# Altium schematic sheet OtherSensors.SchDoc
size A3; SheetNumber: 3; SheetTotal: 3
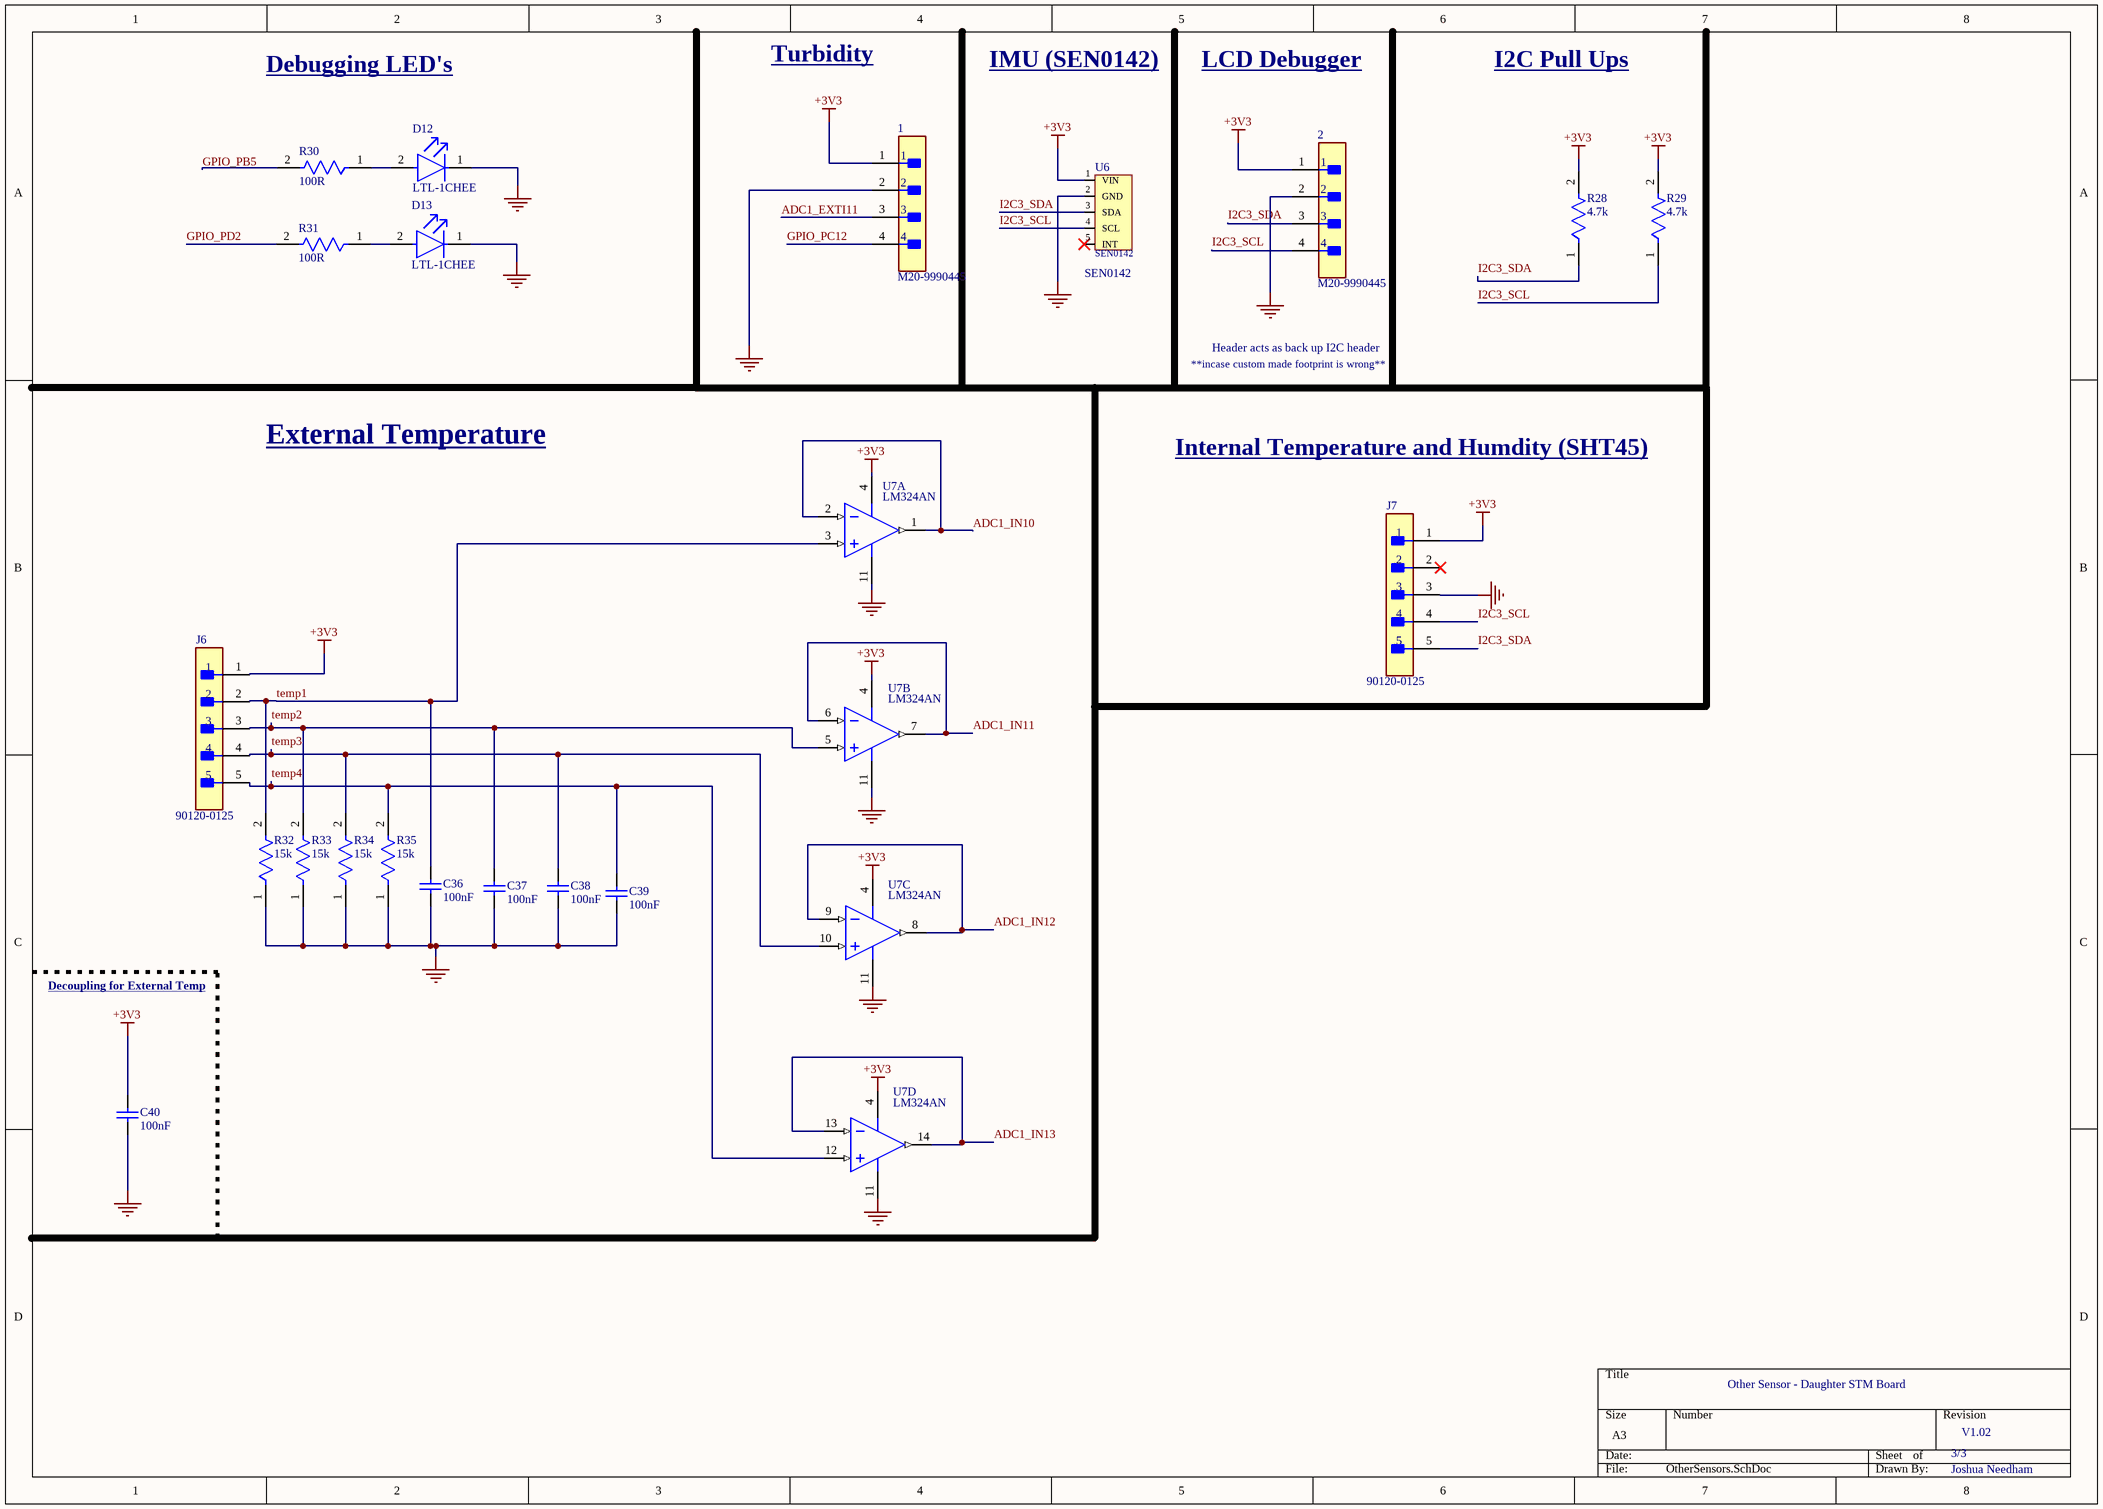
[diagram p0: OtherSensors.SchDoc]

## Parts
1  M20-9990445  [FP-M20-9990445-MFG]
2  M20-9990445  [FP-M20-9990445-MFG]
C36  100nF  [CAPC0805(2012)100_M]
C37  100nF  [CAPC0805(2012)100_M]
C38  100nF  [CAPC0805(2012)100_M]
C39  100nF  [CAPC0805(2012)100_M]
C40  100nF  [CAPC0805(2012)100_M]
D12  LTL-1CHEE  [FP-LTL-1CHEE-MFG]
D13  LTL-1CHEE  [FP-LTL-1CHEE-MFG]
J6  90120-0125  [FP-90120-0125-MFG]
J7  90120-0125  [FP-90120-0125-MFG]
R28  4.7k  [FP-CRCW0805-e3-IPC_A]
R29  4.7k  [FP-CRCW0805-e3-IPC_A]
R30  100R  [FP-CRCW0805-e3-IPC_A]
R31  100R  [FP-CRCW0805-e3-IPC_A]
R32  15k  [FP-CRCW0805-e3-IPC_A]
R33  15k  [FP-CRCW0805-e3-IPC_A]
R34  15k  [FP-CRCW0805-e3-IPC_A]
R35  15k  [FP-CRCW0805-e3-IPC_A]
U6  SEN0142  [PCBComponent_1]
U7  LM324AN  [N0014A]  (parts A,B,C,D of 4)

## Nets
+3V3: 1.1 2.1 C40.2 J6.1 J7.1 R28.2 R29.2 U6.1(VIN) U7.4(V+)
GND: 1.2 2.2 C36.1 C37.1 C38.1 C39.1 C40.1 D12.1(C) D13.1(C) J7.3 R32.1 R33.1 R34.1 R35.1 U6.2(GND) U7.11(GND)
ADC1_EXTI11: 1.3
ADC1_IN10: U7.1(OUT1) U7.2(IN1-)
ADC1_IN11: U7.6(IN2-) U7.7(OUT2)
ADC1_IN12: U7.8(OUT3) U7.9(IN3-)
ADC1_IN13: U7.13(IN4-) U7.14(OUT4)
GPIO_PB5: R30.2
GPIO_PC12: 1.4
GPIO_PD2: R31.2
I2C3_SCL: 2.4 J7.4 R29.1 U6.4(SCL)
I2C3_SDA: 2.3 J7.5 R28.1 U6.3(SDA)
temp1: C36.2 J6.2 R32.2 U7.3(IN1+)
temp2: C37.2 J6.3 R33.2 U7.5(IN2+)
temp3: C38.2 J6.4 R34.2 U7.10(IN3+)
temp4: C39.2 J6.5 R35.2 U7.12(IN4+)
NetD12_2: D12.2(A) R30.1
NetD13_2: D13.2(A) R31.1

Not connected (* = marked no-connect by the designer): J7 2*; U6 5(INT)*

## Notes on the sheet
- Debugging LED's
- Turbidity
- IMU (SEN0142)
- LCD Debugger
- I2C Pull Ups
- **incase custom made footprint is wrong**
- Header acts as back up I2C header
- External Temperature
- Internal Temperature and Humdity (SHT45)
- Decoupling for External Temp
- Other Sensor - Daughter STM Board
- 3/3
- V1.02
- Joshua Needham

## Library data of the parts
1 2 = CMP-00671-05399696-1: M20-9990445 Conn Unshrouded Header HDR 4 POS 2.54mm Solder ST Thru-Hole Bulk/Loose; Insulation Resistance: 10GΩ; Connector Type: Male Pin; Voltage Rating (DC): 750V; Max Current Rating: 3A; Contact Resistance: 25mΩ; Number of Contacts: 4; Gender: Male; Color: Black; Height: 2.54mm; Contact Material: Brass, Bronze, Gold, Nickel; Orientation: Straight; Width: 12.7mm; Mount: Through Hole; Pitch: 2.54mm; Lead Pitch: 2.54mm; RoHS: Compliant; Max Operating Temperature: 105°C; Case/Package: SIL; NexarPartId: 5399696; Depth: 2.54mm; Length: 10.16mm; Current Rating: 3A; Contact Plating: Gold; Radiation Hardening: No; Contact Mating Length: 6.096mm; Voltage Rating (AC): 750V; Termination: Solder; REACH SVHC: No SVHC; Weight: 45.359237g; Number of Rows: 1; Min Operating Temperature: -40°C; Housing Material: Nylon; Housing Color: Black; Number of Positions: 4; Number of Pins: 4
C36-C40 = CMP-1036-04393-1: CAP 100nF 10V ±5% 0805 (2012 Metric) Thickness 1mm SMD; Tolerance: Â±5%; Case-EIA: 0805; Case-Metric: 2012; Rated Voltage: 10 V; Technology: SMT; Value: 100nF; Max Thickness: 1 mm
D12 D13 = CMP-22017-000040-1: LED RED CLEAR T/H; Viewing Angle: 45°; Power Dissipation: 100mW; Wavelength: 635nm; Number of LEDs: 1; Test Current: 10mA; Lens Style: Dome; Forward Current: 30mA; Forward Voltage: 2V; Luminous Intensity: 19mcd; Reverse Voltage: 5V; Dominant Wavelength: 625nm; RoHS Compliant: Yes; Mount: Through Hole; Diameter: 3.1mm; Package Quantity: 1000; Lens Transparency: Clear; Illumination Color: Red; Lens Color: Red; Max Operating Temperature: 100°C; Radiation Hardening: No; Case/Package: T; Width: 3.8mm; Length: 3.8mm; Depth: 3.8mm; Series: -; Number of Pins: 2; Number of Elements: 1; Height: 5.2mm; Max Power Dissipation: 100mW; Lead Free: Lead Free; Packaging: Bulk; Color: Red; Min Operating Temperature: -55°C
J6 J7 = CMP-00257-00655425-1: 90120-0125 2.54mm Pitch C-Grid III Header, Single Row, Vertical, 5 Circuits, Tin (Sn) Plating; NexarPartId: 655425; Manufacturer Lifecycle Status: ACTIVE; Lead Length: 2.9mm; Number of Positions: 5; Current Rating: 3A; Mating Post Length: 6.75mm; Glow Wire Compliant: Non-compliant; Contact Resistance: 20mΩ; Voltage Rating: 350V; Gender: Male; Max Voltage Rating (DC): 350.35kV; Max Operating Temperature: 125°C; Number of Pins: 5; Plating: Tin; Contact Material: Brass; Mount: Through Hole; Contact Gender: Male; Packaging: Bulk; Schedule B: 8536694040; Lifecycle Status: Production; Lead Pitch: 2.54mm; Radiation Hardening: No; Orientation: Vertical; Min Operating Temperature: -55°C; Country of Origin: SK; Housing Color: Black; REACH SVHC: No SVHC; Contact Plating: Tin; Number of Rows: 1; Number of Circuits: 5; Termination: Solder; Number of Contacts: 5; Pitch: 2.54mm; Housing Material: Polyester; RoHS: Compliant; Lead Free: Lead Free; Voltage Rating (AC): 350V
R28-R35 = CMP-2001-04067-2: RES Thick Film, 680Ω, 5%, 0.125W, 200ppm/°C, 0805; Resistance: 680R; Max Power Dissipation: 125mW; Voltage Rating: 150V; Case Code (Imperial): 0805; Packaging: Tape and Reel; Max Operating Temperature: 155°C; Temperature Coefficient: 200ppm/°C; Case/Package: 0805; Features: Automotive AEC-Q200; Width: 1.25mm; Contact Plating: Tin; Weight: 0.000194oz; Radiation Hardening: No; Case Code (Metric): 2012; Military Standard: Not; Lead Free: Lead Free; Length: 2mm; Depth: 1.25mm; Composition: Thick Film; Power Rating: 125mW; Height: 0.45mm; Min Operating Temperature: -55°C; Number of Terminations: 2; Number of Pins: 2; Tolerance: 5%; Package Quantity: 1; Voltage Rating (DC): 150V; Termination: SMD/SMT
U6 = SEN0142: 6 axis IMU
U7 = CMP-0055-00084-3: Low Power Quad Operational Amplifier, 14-pin MDIP; Manufacturer: Texas Instruments; PowerWise: N; PackageTopMarking: NSUZXYYTTE#*LM324AN; CompType: Amplifiers; ComponentLink1URL: http://www.ti.com/general/docs/lit/getliterature.tsp?genericPartNumber=LM324A&fileType=pdf; PinCount: 14; PackageDescription: MDIP, .750 x .250 x.130in, 14 Lead, .100in Pitch; ComponentLink1Description: Datasheet URL; Package Reference: N0014A; Code_JEDEC: MS-001-AA; RoHS: N